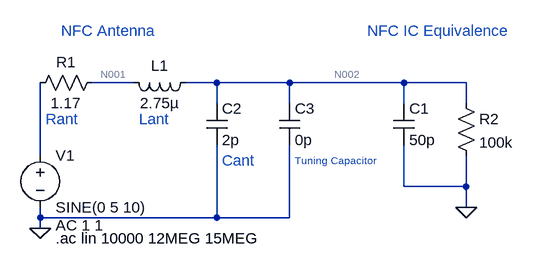
[diagram p0: schematic NFC_LTSpice_Schematic.asc]
NFC_LTSpice_Schematic.asc, the LTspice schematic file:
Version 4
SHEET 1 1008 680
WIRE 416 0 352 0
WIRE 544 0 496 0
WIRE 656 0 544 0
WIRE 832 0 656 0
WIRE 928 0 832 0
WIRE 544 32 544 0
WIRE 656 32 656 0
WIRE 832 32 832 0
WIRE 928 32 928 0
WIRE 272 112 272 0
WIRE 832 160 832 96
WIRE 928 160 928 112
WIRE 928 160 832 160
WIRE 928 192 928 160
WIRE 272 208 272 192
WIRE 544 208 544 96
WIRE 544 208 272 208
WIRE 656 208 656 96
WIRE 656 208 544 208
WIRE 272 224 272 208
FLAG 928 192 0
FLAG 272 224 0
SYMBOL voltage 272 96 R0
WINDOW 123 24 124 Left 2
WINDOW 39 0 0 Left 0
SYMATTR Value2 AC 1 1
SYMATTR InstName V1
SYMATTR Value SINE(0 5 10)
SYMBOL res 368 -16 R90
WINDOW 0 0 56 VBottom 2
WINDOW 3 32 56 VTop 2
SYMATTR InstName R1
SYMATTR Value 1.17
SYMBOL ind 512 -16 R90
WINDOW 0 5 56 VBottom 2
WINDOW 3 32 56 VTop 2
SYMATTR InstName L1
SYMATTR Value 2.75µ
SYMBOL cap 816 32 R0
SYMATTR InstName C1
SYMATTR Value 50p
SYMBOL res 912 16 R0
SYMATTR InstName R2
SYMATTR Value 100k
SYMBOL cap 528 32 R0
SYMATTR InstName C2
SYMATTR Value 2p
SYMBOL cap 640 32 R0
SYMATTR InstName C3
SYMATTR Value 0p
TEXT 296 240 Left 2 !.ac lin 10000 12MEG 15MEG
TEXT 280 56 Left 2 ;Rant
TEXT 424 56 Left 2 ;Lant
TEXT 552 120 Left 2 ;Cant
TEXT 776 -80 Left 2 ;NFC IC Equivalence
TEXT 304 -80 Left 2 ;NFC Antenna
TEXT 664 120 Left 1 ;Tuning Capacitor

The netlist it stands for:
* NFC_LTSpice_Schematic.asc
V1 N003 0 SINE(0 5 10) AC 1 1
R1 N001 N003 1.17
L1 N002 N001 2.75µ
C1 N002 0 50p
R2 N002 0 100k
C2 N002 0 2p
C3 N002 0 0p
.ac lin 10000 12MEG 15MEG
* Rant
* Lant
* Cant
* NFC IC Equivalence
* NFC Antenna
* Tuning Capacitor
.backanno
.end

* Results of the author's LTspice run, read from the files saved beside the schematic
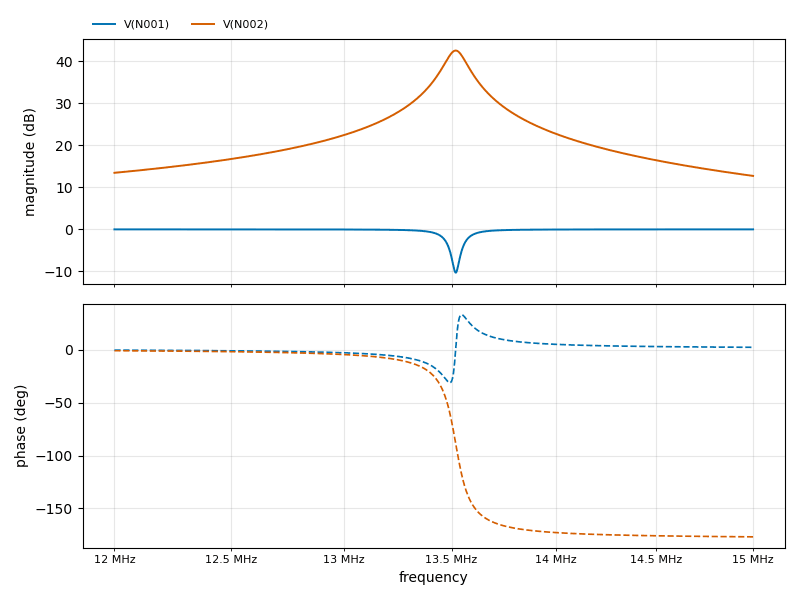
[diagram p1: AC Analysis of NFC_LTSpice_Schematic.asc, plotted from the saved traces]
* AC Analysis, 1 run:
*   V(N001): -0.00 dB at 12 MHz, -0.00 dB at 15 MHz, peak -0.00 dB at 12 MHz, 3 dB below the peak at 13.47 MHz
*   V(N002): 13.46 dB at 12 MHz, 12.72 dB at 15 MHz, peak 42.57 dB at 13.52 MHz, 3 dB below the peak at 13.47 MHz and 13.57 MHz